# EAGLE design EtherWeeny2 (EAGLE 6.2)
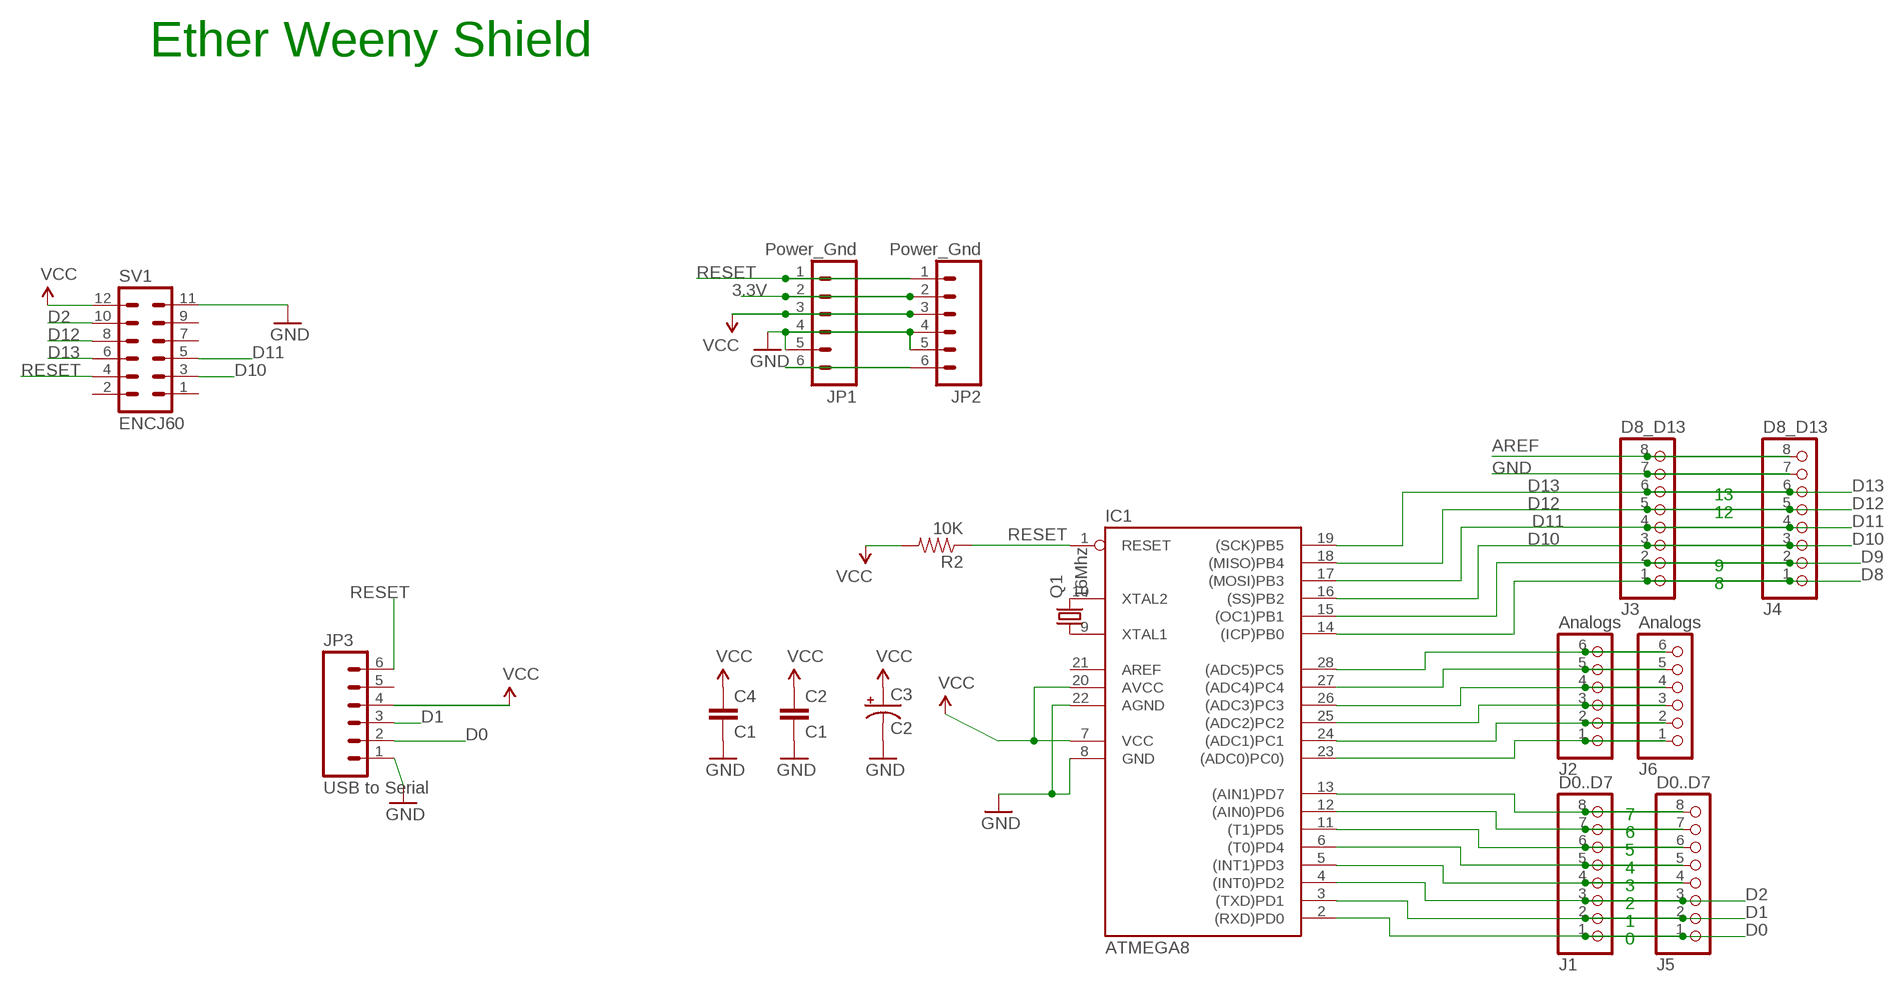
[diagram p0: schematic, sheet 1]

## Parts
C2  C1  CAPPTH  [CAP-PTH-SMALL]
C3  C2  CAP_POLPTH1  [CPOL-RADIAL-100UF-25V]
C4  C1  CAPPTH  [CAP-PTH-SMALL]
IC1  ATMEGA8  AT90S4433P  [DIL28-3]
J1  D0..D7  PINHD-1X8  [1X08]
J2  Analogs  PINHD-1X6  [1X06]
J3  D8_D13  PINHD-1X8  [1X08]
J4  D8_D13  PINHD-1X8  [1X08]
J5  D0..D7  PINHD-1X8  [1X08]
J6  Analogs  PINHD-1X6  [1X06]
JP1  Power_Gnd  M06SIP  [1X06]
JP2  Power_Gnd  M06SIP  [1X06]
JP3  USB to Serial  M06SIP  [1X06]
Q1  16Mhz  CRYSTALHC49US  [HC49US]
R2  10K  RESISTORPTH1  [AXIAL-0.3]
SV1  ENCJ60  MA06-2  [MA06-2]

## Nets
3.3V: JP1.2 JP2.2
AREF [aref]: J3.8 J4.8
D0: IC1.2((RXD)PD0) J1.1 J5.1 JP3.2
D1: IC1.3((TXD)PD1) J1.2 J5.2 JP3.3
D2: IC1.4((INT0)PD2) J1.3 J5.3 SV1.10
D8: IC1.14((ICP)PB0) J3.1 J4.1
D9: IC1.15((OC1)PB1) J3.2 J4.2
D10: IC1.16((SS)PB2) J3.3 J4.3 SV1.3
D11: IC1.17((MOSI)PB3) J3.4 J4.4 SV1.5
D12: IC1.18((MISO)PB4) J3.5 J4.5 SV1.8
D13: IC1.19((SCK)PB5) J3.6 J4.6 SV1.6
GND [gnd]: C2.2 C3.2(-) C4.2 IC1.8(GND) IC1.22(AGND) J3.7 J4.7 JP1.4 JP1.5 JP2.4 JP2.5 JP3.1 SV1.11
N$1: IC1.10(XTAL2) Q1.2
N$2: IC1.9(XTAL1) Q1.1
N$3: JP1.6 JP2.6
N$11: IC1.5((INT1)PD3) J1.4 J5.4
N$12: IC1.6((T0)PD4) J1.5 J5.5
N$13: IC1.11((T1)PD5) J1.6 J5.6
N$14: IC1.12((AIN0)PD6) J1.7 J5.7
N$15: IC1.13((AIN1)PD7) J1.8 J5.8
N$16: IC1.23((ADC0)PC0)) J2.1 J6.1
N$17: IC1.24((ADC1)PC1) J2.2 J6.2
N$18: IC1.25((ADC2)PC2) J2.3 J6.3
N$19: IC1.26((ADC3)PC3) J2.4 J6.4
N$20: IC1.27((ADC4)PC4) J2.5 J6.5
N$21: IC1.28((ADC5)PC5) J2.6 J6.6
RESET: IC1.1(RESET) JP1.1 JP2.1 JP3.6 R2.P$1 SV1.4
VCC: C2.1 C3.1(+) C4.1 IC1.7(VCC) IC1.20(AVCC) JP1.3 JP2.3 JP3.4 R2.P$2 SV1.12
Unconnected: JP3.5 SV1.1 SV1.2 SV1.7 SV1.9

## Notes on the sheet
- Ether Weeny Shield
- 13
- 12
- 9
- 8
- 7
- 6
- 5
- 4
- 3
- 2
- 1
- 0

## Power pins joined to a net without a drawn wire
AREF: IC1.21(AREF)

## Library data of the parts
C2 C4 = SparkFun:CAP: Capacitor Standard 0603 ceramic capacitor, and 0.1" leaded capacitor.
C3 = SparkFun:CAP_POL: Capacitor Polarized These are standard SMD and PTH capacitors. Normally 10uF, 47uF, and 100uF in electrolytic and tantalum varieties. Always verify the external diameter of the through hole cap, it varies with capacity, voltage, and manufacturer. The EIA devices should be standard.
IC1 = atmel:AT90S4433: MICROCONTROLLER 4 Kbytes FLASH 128 bytes SRAM 256 bytes EEPROM UART 6-channel 10 bit ADC
J1 J3-J5 = pinhead:PINHD-1X8: PIN HEADER
J2 J6 = pinhead:PINHD-1X6: PIN HEADER
JP1-JP3 = SparkFun:M06: Header 6 Standard 6-pin 0.1" header. Use with straight break away headers (SKU : PRT-00116), right angle break away headers (PRT-00553), swiss pins (PRT-00743), machine pins (PRT-00117), and female headers (PRT-00115). Molex polarized connector foot print use with SKU : PRT-08094 with associated crimp pins and housings. NOTES ON THE VARIANTS LOCK and LOCK_LONGPADS... This footprint was designed to help hold the alignment of a through-hole component (i.e. 6-pin header) while soldering it into place. You may notice that each hole has been shifted either up or down by 0.005 of an inch from it's more standard position (which is a perfectly straight line). This slight alteration caused the pins (the squares in the middle) to touch the edges of the holes. Because they are alternating, it causes a "brace" to hold the component in place. 0.005 has proven to be the perfect amount of "off-center" position when using our standard breakaway headers. Although looks a little odd when you look at the bare footprint, once you have a header in there, the alteration is very hard to notice. Also, if you push a header all the way into place, it is covered up entirely on the bottom side. This idea of altering the position of holes to aid alignment will be further integrated into the Sparkfun Library for other footprints. It can help hold any component with 3 or more connection pins.
Q1 = SparkFun:CRYSTAL: Crystals Various standard crystals. Proven footprints. Spark Fun Electronics SKU : COM-00534
R2 = SparkFun:RESISTOR: Resistor Basic schematic elements and footprints for 0603, 1206, and PTH 1/10th watt (small) resistors.
SV1 = con-lstb:MA06-2: PIN HEADER; OC_FARNELL: unknown; OC_NEWARK: unknown

## Net classes
0 default: width 0.254 mm, clearance 0.254 mm
1 power: width 0.61 mm, drill 0.711 mm, clearance 0.33 mm
2 gnd: width 0.305 mm, drill 0.711 mm, clearance 0.254 mm
3 usbvcc: width 0.508 mm, drill 0.711 mm, clearance 0.254 mm
4 aref: width 0.406 mm

## Board
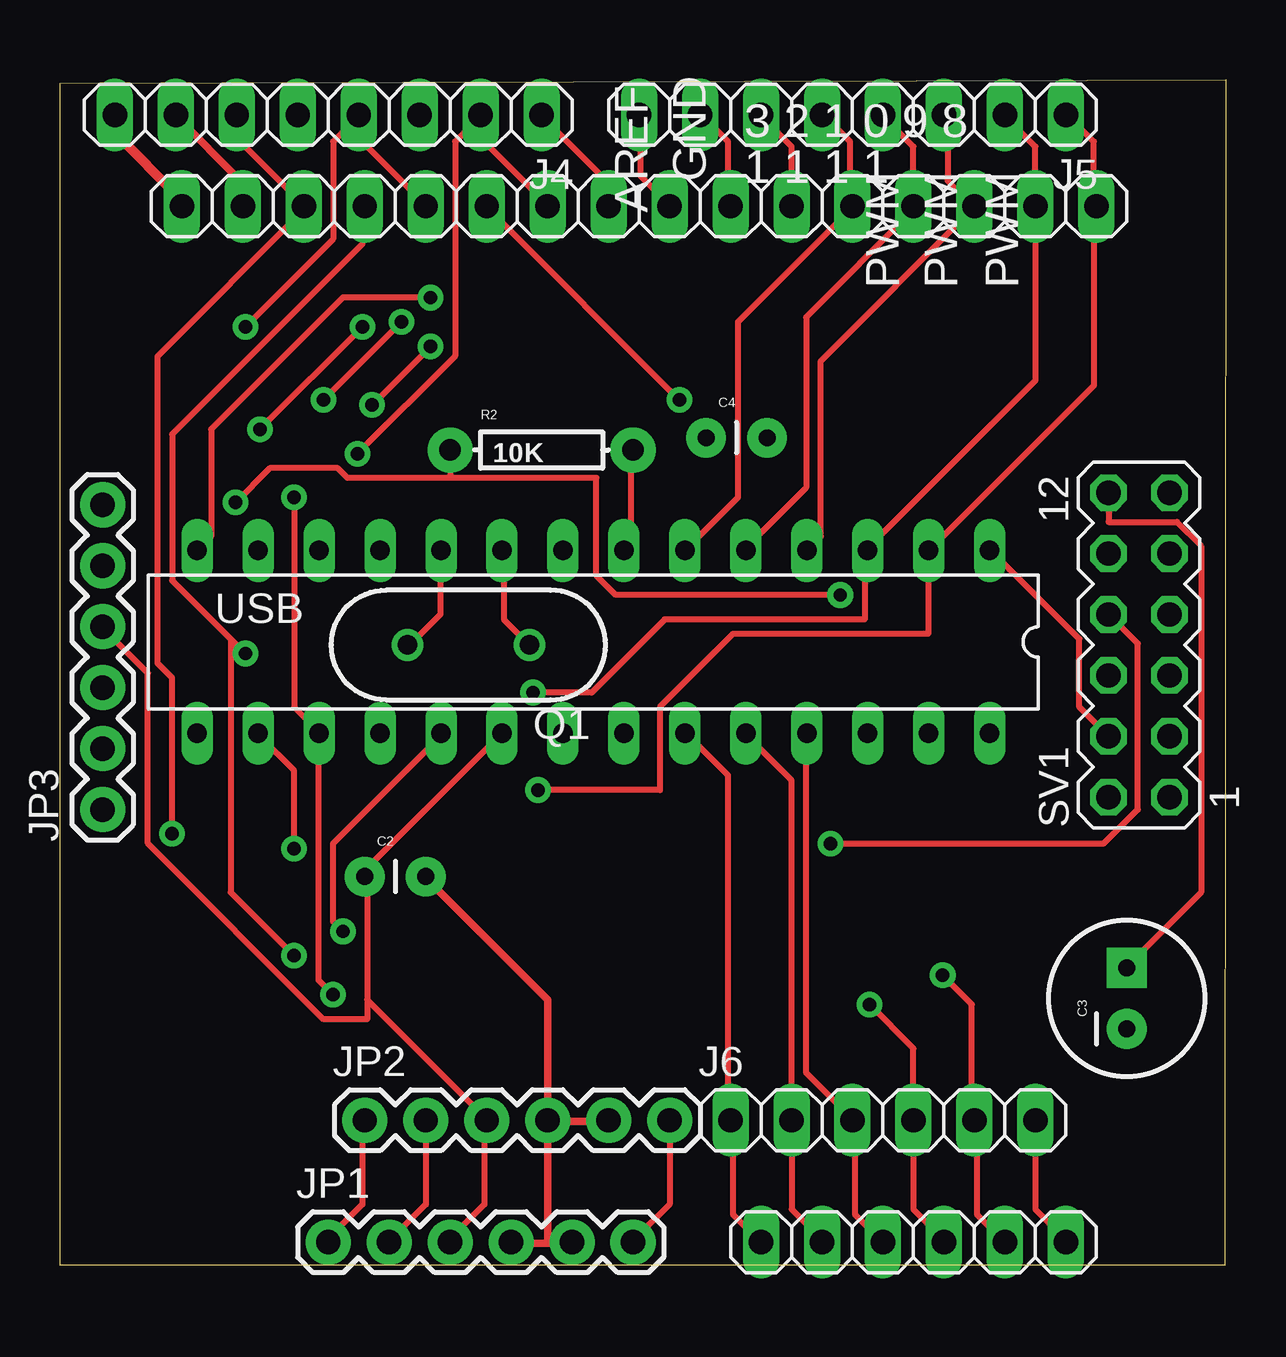
[diagram p1: board, top side]
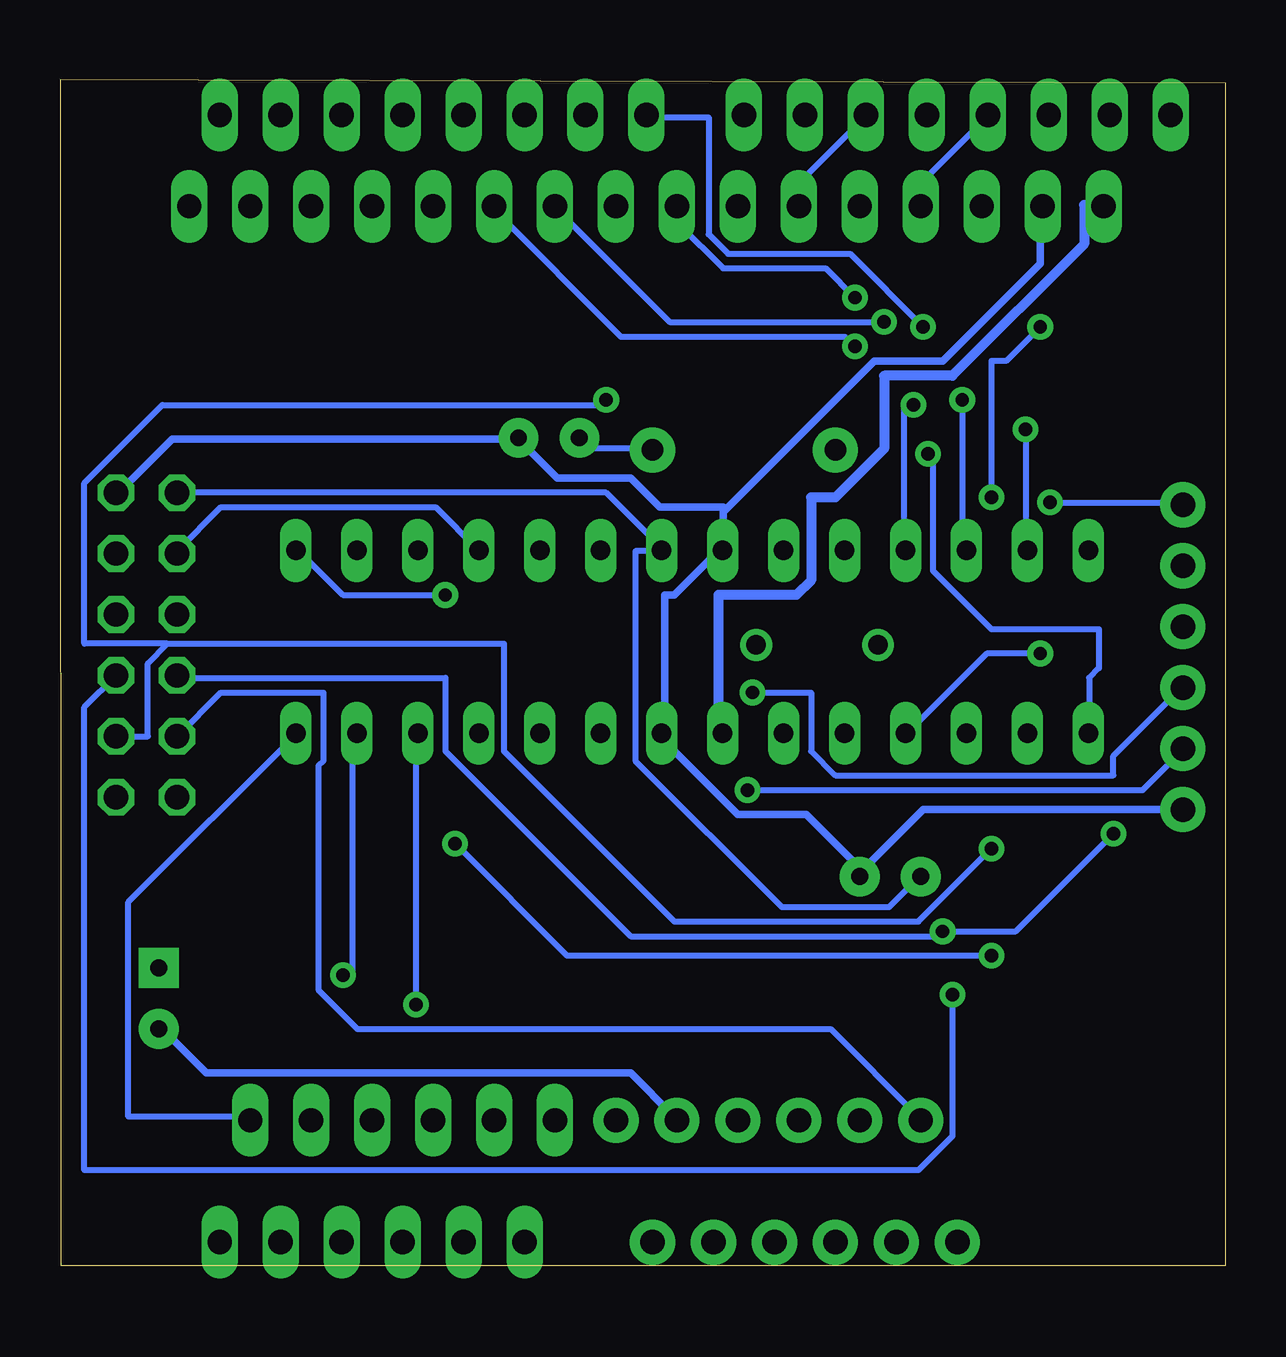
[diagram p2: board, bottom side, seen from below]

Size 48.56 x 49.43 mm. Coordinates in mm from the lower left corner, seen from the top.
Outline: 0,49.28 42.8,49.4 48.56,49.43 48.54,0 0,0 0,49.28
Copper layers (1*16): Top 0.035mm / dielectric 1.5mm / Bottom 0.035mm
Design rules: minimum track width 10mil, minimum drill 22mil, track to track 10mil, track to pad 10mil, pad to pad 10mil, via to via 16mil, smd to smd 8mil, copper to edge 30mil, drill to drill 12mil, minimum pad ring 10mil, minimum via ring 10mil, stop-mask expansion 4mil, vias tented up to drill 0mil, thermal gap 10mil
vRestrict: area 25.4,45.2 to 27.1,48.8; area 33.4,40.7 to 34.9,44.3; area 35.9,40.7 to 37.5,44.3; area 38.5,40.7 to 40,44.3; area 42.5,38.3 to 43.1,38.6

### Footprints (pad centres in the part's own frame; a part is rotated, then mirrored left to right if it is on the bottom)
CAP-PTH-SMALL = drill 0.7 pad 1.651: 1 0,0; 2 2.54,0
CPOL-RADIAL-100UF-25V = drill 0.7 pad 1.651 square: 1 1.27,0 | drill 0.7 pad 1.651: 2 -1.27,0
DIL28-3 = drill 0.813 long: 1 -16.51,-3.81; 2 -13.97,-3.81; 3 -11.43,-3.81; 4 -8.89,-3.81; 5 -6.35,-3.81; 6 -3.81,-3.81; 7 -1.27,-3.81; 8 1.27,-3.81; 9 3.81,-3.81; 10 6.35,-3.81; 11 8.89,-3.81; 12 11.43,-3.81; 13 13.97,-3.81; 14 16.51,-3.81; 15 16.51,3.81; 16 13.97,3.81; 17 11.43,3.81; 18 8.89,3.81; 19 6.35,3.81; 20 3.81,3.81; 21 1.27,3.81; 22 -1.27,3.81; 23 -3.81,3.81; 24 -6.35,3.81; 25 -8.89,3.81; 26 -11.43,3.81; 27 -13.97,3.81; 28 -16.51,3.81
1X08 = drill 1.016 long: 1 -8.89,0; 2 -6.35,0; 3 -3.81,0; 4 -1.27,0; 5 1.27,0; 6 3.81,0; 7 6.35,0; 8 8.89,0
1X06 = drill 1.016 long: 1 -6.35,0; 2 -3.81,0; 3 -1.27,0; 4 1.27,0; 5 3.81,0; 6 6.35,0
1X06' = drill 1.016 pad 1.88: 1 0,0; 2 2.54,0; 3 5.08,0; 4 7.62,0; 5 10.16,0; 6 12.7,0
HC49US = drill 0.813: 1 -2.54,0; 2 2.54,0
AXIAL-0.3 = drill 0.9 pad 1.88: P$1 -3.81,0; P$2 3.81,0
MA06-2 = drill 1.016 octagon: 1 -6.35,-1.27; 2 -6.35,1.27; 3 -3.81,-1.27; 4 -3.81,1.27; 5 -1.27,-1.27; 6 -1.27,1.27; 7 1.27,-1.27; 8 1.27,1.27; 9 3.81,-1.27; 10 3.81,1.27; 11 6.35,-1.27; 12 6.35,1.27

### Placement (x,y rotation side)
C2  12.7,16.21 0 top
C3  44.45,11.13 90 top
C4  26.92,34.49 0 top
IC1  22.23,25.98 180 top
J1  34.29,44.15 180 top
J2  35.56,0.97 0 top
J3  13.97,44.15 180 top
J4  11.18,47.96 180 top
J5  33.02,47.96 180 top
J6  34.29,6.05 0 top
JP1  Power_Gnd  [1X06']  11.18,0.97 0 top
JP2  Power_Gnd  [1X06']  12.7,6.05 0 top
JP3  USB to Serial  [1X06']  1.78,19 90 top
Q1  17.02,25.86 180 top
R2  20.07,33.99 0 top
SV1  44.96,25.86 90 top

### Tracks (layer width: path | path; a pad name or v marks a point on that pad's centre or on a via)
3.3V
  Top 0.254: JP2.2 15.24,2.54 13.82,1.12 JP1.2
AREF
  Top 0.406: J3.8 5.08,44.4 2.23,47.24 2.23,47.85 J4.8
  Bottom 0.406: IC1.21 21.13,22.25 21.13,27.94 17.88,27.94 17.27,28.55 17.27,32 16.26,32 14.22,34.04 14.22,37.08 11.38,37.08 5.89,42.57 5.89,44.2 5.08,44.2 J3.8
D0  (via drill 0.56)
  Top 0.254: J5.1 42.06,47.85 43.08,46.84 43.08,44.2 J1.1 43.08,43.99 43.08,36.68 IC1.2 36.17,29.77 36.17,26.31 28.04,26.31 24.99,23.27 24.99,19.81 v19.91,19.81
  Bottom 0.254: v19.91,19.81 3.45,19.81 1.83,21.44 JP3.2
D1  (via drill 0.56)
  Top 0.254: J5.2 39.42,47.85 40.64,46.63 J1.2 40.64,36.88 33.73,29.97 IC1.3 33.53,29.77 33.53,26.92 25.2,26.92 22.15,23.88 v19.71,23.88
  Bottom 0.254: v19.71,23.88 17.27,23.88 17.27,21.44 16.26,20.42 4.67,20.42 4.67,21.23 1.83,24.08 JP3.3
D2
  Top 0.254: J5.3 36.98,47.85 36.98,45.21 38,44.2 J1.3 38,43.99 31.7,37.69 31.7,30.38 IC1.4
  Bottom 0.254: IC1.4 32.92,31.6 41.86,31.6 43.69,29.77 SV1.10
D8  (via drill 0.56)
  Top 0.254: IC1.14 6.3,30.38 6.3,34.85 11.79,40.34 v15.44,40.34 | J4.1 20.12,47.85 22.76,45.21 22.76,44.2 J3.1
  Bottom 0.254: v15.44,40.34 16.66,41.55 20.93,41.55 22.76,43.38 22.76,43.99 J3.1
D9  (via drill 0.56)
  Top 0.254: v12.39,33.83 16.46,37.9 16.46,46.84 17.07,47.45 | 17.07,47.45 17.48,47.85 J4.2 17.07,47.45 | 17.07,47.45 20.32,44.2 J3.2
  Bottom 0.254: v12.39,33.83 12.19,33.83 12.19,28.96 9.75,26.52 5.28,26.52 5.28,24.89 5.69,24.49 5.69,22.25 IC1.15
D10  (via drill 0.56)
  Top 0.254: v9.75,17.37 9.75,20.63 8.33,22.05 IC1.16 | v25.81,36.07 17.88,43.99 J3.3
  Bottom 0.254: J4.3 15.04,47.85 17.68,45.21 17.68,44.2 J3.3 | v9.75,17.37 12.8,14.33 22.96,14.33 30.07,21.44 30.07,25.91 44.09,25.91 | 44.09,25.91 44.91,25.1 44.91,22.05 SV1.3 | v25.81,36.07 26.01,35.87 44.3,35.87 47.55,32.61 47.55,25.91 44.09,25.91
D11  (via drill 0.56)
  Top 0.254: v9.75,32 9.75,23.27 10.77,22.25 IC1.17 10.77,22.05 10.77,11.89 v11.38,11.28 | v7.72,39.12 11.38,42.77 11.38,46.84 11.99,47.45 | 11.99,47.45 12.39,47.85 J4.4 11.99,47.45 | 11.99,47.45 15.24,44.2 J3.4
  Bottom 0.254: v9.75,32 9.75,37.69 9.14,37.69 v7.72,39.12 | SV1.5 47.55,23.27 47.55,3.96 12.8,3.96 11.38,5.39 v11.38,11.28
D12  (via drill 0.56)
  Top 0.254: 7.11,26.11 4.67,28.55 4.67,34.65 12.6,42.57 12.6,43.99 J3.5 | 7.11,26.11 v7.72,25.5 | SV1.8 44.91,25.91 44.91,19 43.48,17.58 v32.11,17.58 | v9.75,12.9 7.11,15.55 7.11,26.11
  Bottom 0.254: v7.72,25.5 9.96,25.5 13.21,22.25 IC1.18 | v32.11,17.58 27.43,12.9 v9.75,12.9 | J4.5 9.96,47.85 12.6,45.21 12.6,44.2 J3.5
D13  (via drill 0.56)
  Top 0.254: J4.6 7.52,47.85 7.52,46.84 10.16,44.2 J3.6 10.16,43.99 4.06,37.9 4.06,25.1 4.67,24.49 v4.67,17.98 | v11.79,13.92 11.38,14.33 11.38,17.58 15.85,22.05 IC1.19
  Bottom 0.254: SV1.6 43.69,24.49 32.51,24.49 32.51,21.44 24.79,13.72 11.99,13.72 v11.79,13.92 8.74,13.92 v4.67,17.98
GND
  Top 0.305: 20.32,0.91 21.34,0.91 JP1.5 | 20.32,0.91 18.9,0.91 JP1.4 | C2.2 15.24,16.15 20.32,11.07 JP2.4 20.32,5.99 | 20.32,5.99 20.32,0.91 | 20.32,5.99 22.76,5.99 JP2.5 | J4.7 4.88,47.85 7.52,45.21 7.52,44.2 J3.7
  Bottom 0.305: C3.2 44.3,9.86 42.47,8.03 24.79,8.03 22.96,6.2 JP2.5 | JP3.1 12.6,19 15.24,16.36 C2.2 15.24,16.56 17.48,18.8 20.32,18.8 23.57,22.05 IC1.22 23.37,22.25 23.37,27.94 22.96,27.94 21.13,29.77 IC1.8 20.93,29.97 20.93,31.39 20.83,31.5 | 29.46,34.44 43.89,34.44 46.13,32.21 SV1.11 | 20.83,31.5 14.63,37.69 11.79,37.69 7.72,41.76 7.72,43.99 J3.7 | 29.46,34.44 27.84,32.82 24.79,32.82 23.57,31.6 20.93,31.6 20.83,31.5 | 29.46,34.44 C4.2
N$1
  Top 0.254: Q1.2 14.63,25.91 15.85,27.13 15.85,29.77 IC1.10
N$2
  Top 0.254: Q1.1 18.49,26.92 18.49,29.77 IC1.9
N$3
  Top 0.254: JP2.6 25.4,2.54 23.98,1.12 JP1.6
N$11
  Top 0.254: IC1.5 28.65,29.97 31.09,32.41 31.09,39.52 35.56,43.99 J1.4 35.56,46.63 34.34,47.85 J5.4
N$12
  Top 0.254: IC1.6 28.25,32 28.25,39.32 32.92,43.99 J1.5 32.92,44.2 32.92,46.84 31.9,47.85 J5.5
N$13  (via drill 0.56)
  Top 0.254: v15.44,38.3 v13.01,35.87 | J1.6 30.48,46.63 29.26,47.85 J5.6
  Bottom 0.254: v13.01,35.87 13.41,35.87 13.41,29.97 IC1.11 | v15.44,38.3 15.85,38.71 25.2,38.71 30.48,43.99 J1.6
N$14  (via drill 0.56)
  Top 0.254: v14.22,39.32 v10.97,36.07 | J5.7 26.82,47.85 27.84,46.84 27.84,44.2 J1.7
  Bottom 0.254: v10.97,36.07 10.97,29.97 IC1.12 | v14.22,39.32 23.16,39.32 27.84,43.99 J1.7
N$15  (via drill 0.56)
  Top 0.254: v12.6,39.12 v8.33,34.85 | J1.8 25.4,44.2 24.18,45.42 24.18,47.85 J5.8
  Bottom 0.254: v8.33,34.85 8.33,29.97 IC1.13 | v12.6,39.12 15.65,42.16 20.73,42.16 21.54,42.98 21.54,47.85 23.98,47.85 J5.8
N$16
  Top 0.254: IC1.23 26.21,22.05 27.84,20.42 27.84,6.2 J6.1 28.04,5.99 28.04,2.13 J2.1
N$17
  Top 0.254: IC1.24 28.65,22.05 30.48,20.22 J6.2 30.48,2.34 31.7,1.12 J2.2
N$18
  Top 0.254: IC1.25 31.09,22.05 31.09,8.03 32.92,6.2 J6.3 33.12,5.99 33.12,2.13 J2.3
N$19  (via drill 0.56)
  Top 0.254: v33.73,10.87 35.56,9.04 J6.4 35.56,2.34 36.78,1.12 J2.4
  Bottom 0.254: v33.73,10.87 33.73,22.05 IC1.26
N$20  (via drill 0.56)
  Top 0.254: v36.78,12.09 38,10.87 38,6.2 J6.5 38.2,5.99 38.2,2.13 J2.5
  Bottom 0.254: v36.78,12.09 36.37,12.09 36.37,22.05 IC1.27
N$21
  Top 0.254: J6.6 40.64,2.34 41.86,1.12 J2.6
  Bottom 0.254: IC1.28 38.81,22.05 45.72,15.14 45.72,6.2 40.64,6.2 J6.6
RESET  (via drill 0.56)
  Top 0.254: v7.32,31.8 8.74,33.22 11.58,33.22 11.99,32.82 16.26,32.82 | R2.P$1 16.26,32.82 | JP1.1 11.18,1.12 12.6,2.54 12.6,5.99 JP2.1 | SV1.4 42.47,23.27 42.47,26.11 38.81,29.77 IC1.1 | 16.26,32.82 22.35,32.82 22.35,28.75 23.16,27.94 v32.51,27.94
  Bottom 0.254: v7.32,31.8 1.83,31.8 JP3.6 | SV1.4 41.86,23.88 37.59,23.88 37.59,21.03 37.8,20.83 37.8,11.48 36.17,9.86 16.46,9.86 12.8,6.2 JP2.1 | v32.51,27.94 36.78,27.94 38.61,29.77 IC1.1
VCC
  Top 0.254: JP1.3 16.26,1.12 17.68,2.54 17.68,5.99 JP2.3 17.68,6.2 12.8,11.07 | IC1.20 12.8,16.56 12.8,16.36 C2.1 12.8,16.15 12.8,11.07 | 12.8,11.07 12.8,10.26 10.97,10.26 3.66,17.58 3.66,24.69 1.83,26.52 JP3.4 | IC1.7 23.57,29.97 23.77,30.18 23.77,33.83 R2.P$2 | SV1.12 43.69,30.99 46.53,30.99 47.55,29.97 47.55,15.55 44.5,12.5 C3.1
  Bottom 0.254: SV1.12 25.81,32.21 23.57,29.97 IC1.7 23.57,29.77 24.59,29.77 24.59,21.03 18.49,14.94 14.02,14.94 12.8,16.15 C2.1 | C4.1 26.82,34.44 26.42,34.04 23.98,34.04 R2.P$2

### Text on the board
tNames: 3 2 1 0 9 8 | GND | 1 1 1 1 | AREF | PWM | PWM | PWM | USB
Reference: C8 | C2 | R11 | C4 | C5